# EAGLE design Qwiic_High_Performance_Magnetometer (EAGLE 9.6.2)
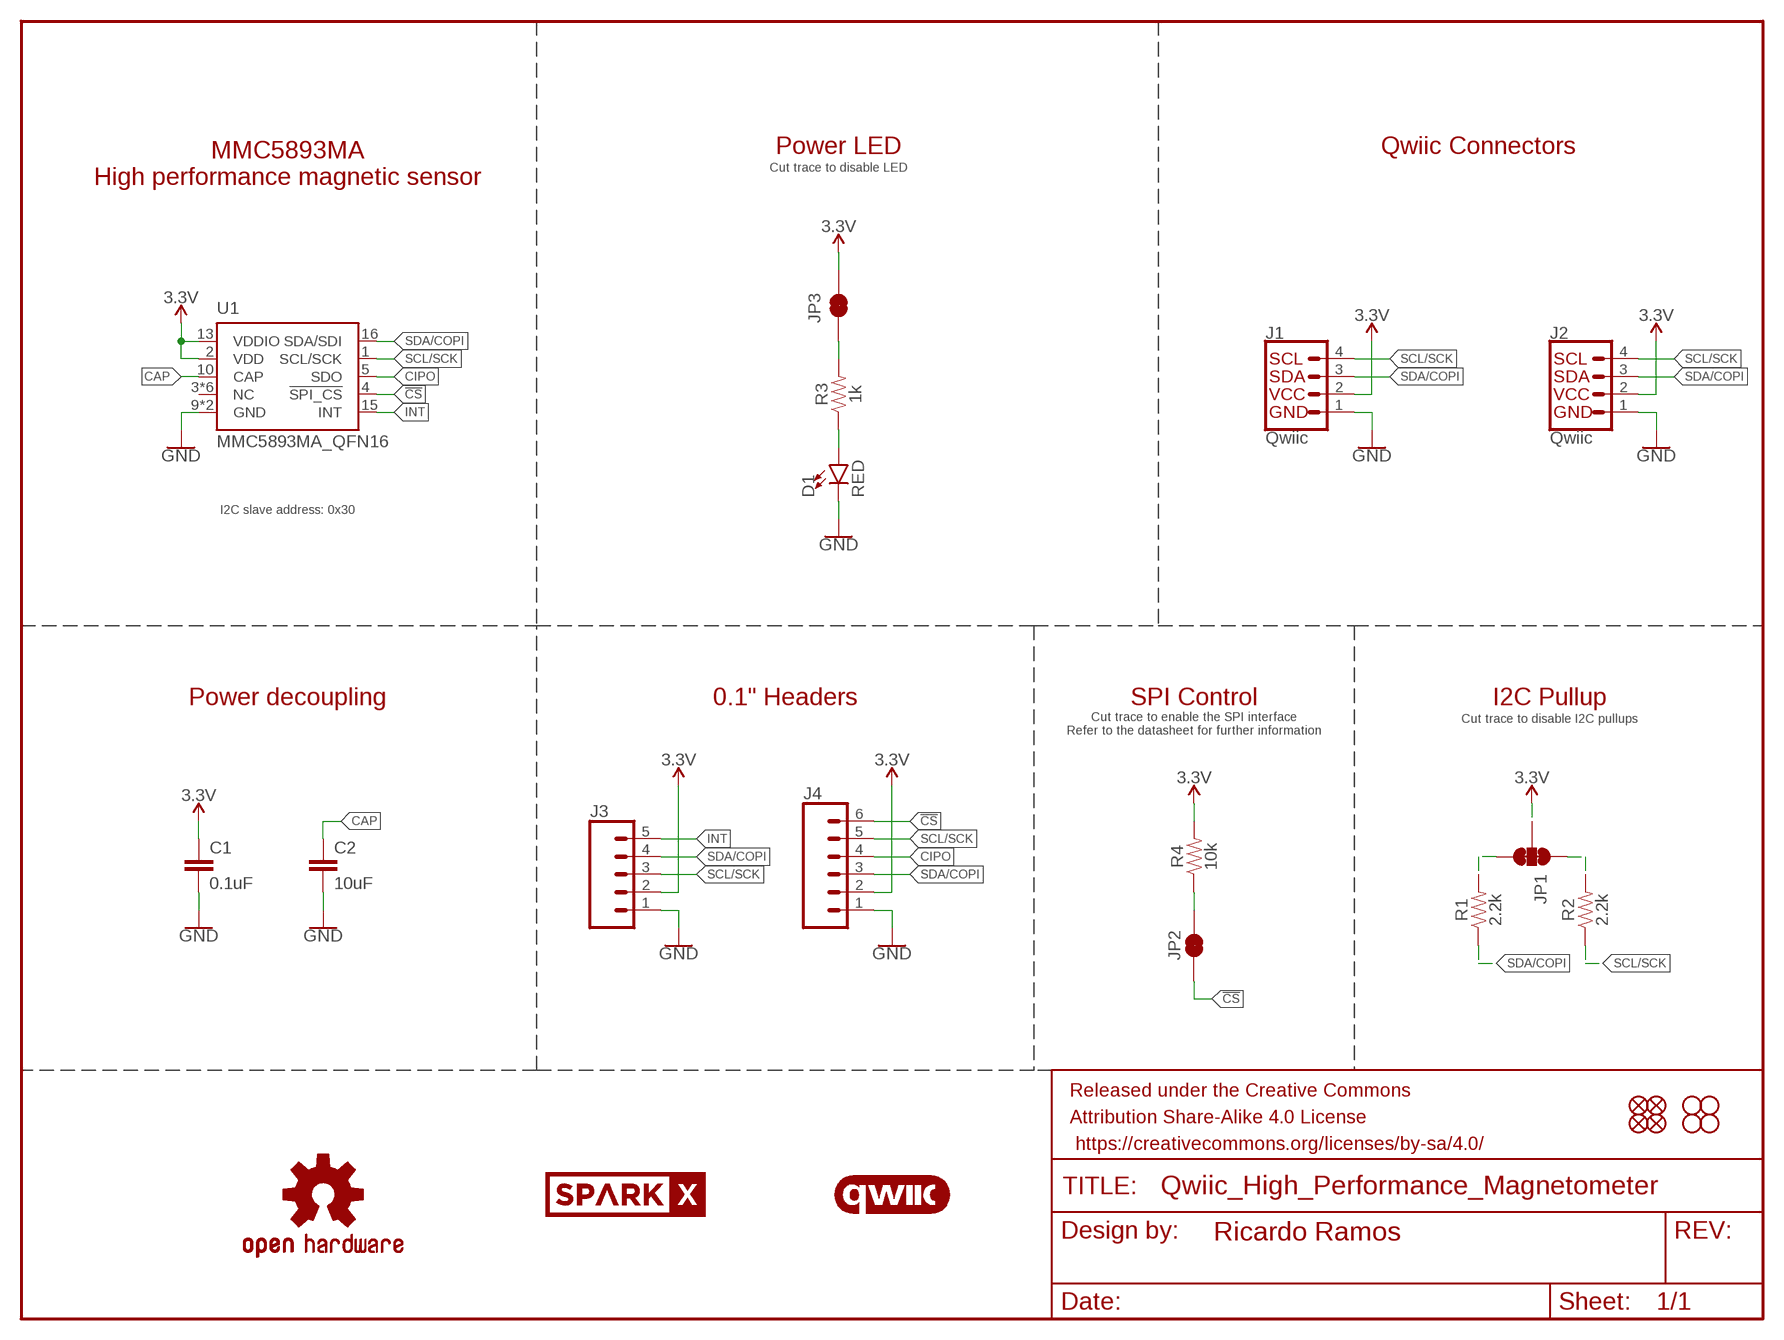
[diagram p0: schematic, sheet 1]

## Parts
C1  0.1uF  0.1UF-0603-25V-(+80/-20%)  [0603]
C2  10uF  10UF-0603-6.3V-20%  [0603]
D1  RED  LED-RED0603  [LED-0603]
FD1  FIDUCIAL1X2  [FIDUCIAL-1X2]
FD2  FIDUCIAL1X2  [FIDUCIAL-1X2]
FD3  FIDUCIAL1X2  [FIDUCIAL-1X2]
FD4  FIDUCIAL1X2  [FIDUCIAL-1X2]
FRAME1  FRAME-LETTERNO_PACKAGE  [DUMMY]
H1  STAND-OFF  [STAND-OFF]
H2  STAND-OFF  [STAND-OFF]
H3  STAND-OFF  [STAND-OFF]
H4  STAND-OFF  [STAND-OFF]
J1  Qwiic  QWIIC_CONNECTORJS-1MM  [JST04_1MM_RA]
J2  Qwiic  QWIIC_CONNECTORJS-1MM  [JST04_1MM_RA]
J3  CONN_05NO_SILK  [1X05_NO_SILK]
J4  CONN_06NO_SILK_NO_POP  [1X06_NO_SILK]
JP1  JUMPER-SMT_3_2-NC_TRACE_SILK  [SMT-JUMPER_3_2-NC_TRACE_SILK]
JP2  JUMPER-SMT_2_NC_TRACE_SILK  [SMT-JUMPER_2_NC_TRACE_SILK]
JP3  JUMPER-SMT_2_NC_TRACE_SILK  [SMT-JUMPER_2_NC_TRACE_SILK]
LOGO1  OSHW-LOGOMINI  [OSHW-LOGO-MINI]
LOGO2  QWIIC_LOGO_5MM  [QWIIC_5MM]
R1  2.2k  2.2KOHM-0603-1/10W-1%  [0603]
R2  2.2k  2.2KOHM-0603-1/10W-1%  [0603]
R3  1k  1KOHM-0603-1/10W-1%  [0603]
R4  10k  10KOHM-0603-1/10W-1%  [0603]
U1  MMC5893MA_QFN16  [LGA-16-3X3MM-4X4PINS]
U$36  SPARKX-LOGO2  [SPARKX-TINY]
U$37  SPARKX-LOGO3  [SPARKX-SMALL]

## Nets
3.3V: C1.1 J1.2 J2.2 J3.2 J4.2 JP1.2 JP3.2 R4.2 U1.2(VDD) U1.13(VDDIO)
!CS!: J4.6 JP2.1 U1.4(!SPI_CS!)
CAP: C2.1 U1.10(CAP)
CIPO: J4.4 U1.5(SDO)
GND: C1.2 C2.2 D1.C J1.1 J2.1 J3.1 J4.1 U1.9(GND) U1.11(GND)
INT: J3.5 U1.15(INT)
N$1: JP3.1 R3.2
N$2: JP1.1 R2.2
N$3: JP1.3 R1.2
N$4: D1.A R3.1
N$5: JP2.2 R4.1
SCL/SCK: J1.4 J2.4 J3.3 J4.5 R2.1 U1.1(SCL/SCK)
SDA/COPI: J1.3 J2.3 J3.4 J4.3 R1.1 U1.16(SDA/SDI)
Unconnected: U1.3(NC) U1.6(NC) U1.7(NC) U1.8(NC) U1.12(NC) U1.14(NC)

## Notes on the sheet
- Power LED | Qwiic Connectors
- MMC5893MA
  High performance magnetic sensor
- Cut trace to disable LED
- I2C slave address: 0x30
- Power decoupling | 0.1" Headers | SPI Control | I2C Pullup
- Cut trace to enable the SPI interface
  Refer to the datasheet for further information
- Cut trace to disable I2C pullups

## Library data of the parts
C1 = SparkFun-Capacitors:0.1UF: 0.1µF ceramic capacitors A capacitor is a passive two-terminal electrical component used to store electrical energy temporarily in an electric field.; PROD_ID: CAP-00810
C2 = SparkFun-Capacitors:10UF: 10.0µF ceramic capacitors A capacitor is a passive two-terminal electrical component used to store electrical energy temporarily in an electric field.; PROD_ID: CAP-11015
D1 = SparkFun-LED:LED-RED: Red SMD LED Used in manufacturing of most products at SparkFun Packages: 0603 - SMD 0603 package [Product Link] <http://docs.avagotech.com/docs/AV02-0551EN> 0603 SMART - SMD 0603 SMART package ( more efficient and expensive)[Product Link] <http://www.osram-os.com/Graphics/XPic2/00077099_0.pdf> 1206 - SMD1206 package [Product Link] <https://www.sparkfun.com/datasheets/DevTools/LilyPad/Q150OVS4.pdff> SparkFun Products: Pro Mini 328 -5V <https://www.sparkfun.com/products/821> RedBoard <https://www.sparkfun.com/products/12757> IOIO-OTG <https://www.sparkfun.com/products/13613>; PROD_ID: DIO-00819
FD1-FD4 = SparkFun-Aesthetics:FIDUCIAL: Fiducial Alignment Points Point-of-reference for pick-and-place machines and other optical instruments.
FRAME1 = SparkFun-Aesthetics:FRAME-LETTER: Schematic Frame - Letter Standard 8.5x11 US Letter frame; DESIGNER: Ricardo Ramos; VERSION: v01
H1-H4 = SparkFun-Hardware:STAND-OFF: Stand Off Drill holes for mechanically mounting via screws, standoffs, etc. Note: Use the keepout ring to avoid running the screw head into surrounding components. Variant Overviews STAND-OFF - Mechanical footprint for a #4 phillips button head screw. STAND-OFF-TIGHT - Mechanical footprint for a #4 phillips button head screw, Example SparkFun Products Screw - Phillips Head (1/4", 4-40, 10 pack) <https://www.sparkfun.com/products/10453> (PRT-10453) Screw - Phillips Head (1/2", 4-40, 10 pack) <https://www.sparkfun.com/products/10452> (PRT-10452) Screw - Phillips Head (3/4", 4-40, 10 pack) <https://www.sparkfun.com/products/10451> (PRT-10451) Screw - Phillips Head (1", 4-40, 10 pack) <https://www.sparkfun.com/products/10450> (PRT-10450)
J1 J2 = SparkFun-Connectors:QWIIC_CONNECTOR: SparkFun I2C Standard Qwiic Connector An SMD 1mm pitch JST connector makes it easy and quick (get it? Qwiic?) to connect I2C devices to each other. The Qwiic system <http://www.sparkfun.com/qwiic> enables fast and solderless connection between popular platforms and various sensors and actuators. We carry 200mm <https://www.sparkfun.com/products/14204>, 100mm <https://www.sparkfun.com/products/14205>, 50mm <https://www.sparkfun.com/products/14206>, and breadboard friendly <https://www.sparkfun.com/products/14207> Qwiic cables. We also offer 10 pcs strips <https://www.sparkfun.com/products/14323> the SMD connectors.; PROD_ID: CONN-13694; VALUE: QWIIC_RIGHT_ANGLE
J3 = SparkFun-Connectors:CONN_05: Multi connection point. Often used as Generic Header-pin footprint for 0.1 inch spaced/style header connections On any of the 0.1 inch spaced packages, you can populate with these: Break Away Headers - Straight <https://www.sparkfun.com/products/116> (PRT-00116) Break Away Male Headers - Right Angle <https://www.sparkfun.com/products/553> (PRT-00553) Female Headers <https://www.sparkfun.com/products/115> (PRT-00115) Break Away Headers - Machine Pin <https://www.sparkfun.com/products/117> (PRT-00117) Break Away Female Headers - Swiss Machine Pin <https://www.sparkfun.com/products/743> (PRT-00743) For SCREWTERMINALS and SPRING TERMINALS visit here: Screw Terimnals on SparkFun.com <https://www.sparkfun.com/search/results?term=Screw+Terminals> (5mm/3.5mm/2.54mm spacing) This device is also useful as a general connection point to wire up your design to another part of your project. Our various solder wires solder well into these plated through hole pads. Hook-Up Wire - Assortment (Stranded, 22 AWG) <https://www.sparkfun.com/products/11375> (PRT-11375) Hook-Up Wire - Assortment (Solid Core, 22 AWG) <https://www.sparkfun.com/products/11367> (PRT-11367) View the entire wire category on our website here <https://www.sparkfun.com/categories/141> Special notes: Molex polarized connector foot print use with SKU : PRT-08231 with associated crimp pins and housings. 1MM SMD Version SKU: PRT-10208
J4 = SparkFun-Connectors:CONN_06: Multi connection point. Often used as Generic Header-pin footprint for 0.1 inch spaced/style header connections On any of the 0.1 inch spaced packages, you can populate with these: Break Away Headers - Straight <https://www.sparkfun.com/products/116> (PRT-00116) Break Away Male Headers - Right Angle <https://www.sparkfun.com/products/553> (PRT-00553) Female Headers <https://www.sparkfun.com/products/115> (PRT-00115) Break Away Headers - Machine Pin <https://www.sparkfun.com/products/117> (PRT-00117) Break Away Female Headers - Swiss Machine Pin <https://www.sparkfun.com/products/743> (PRT-00743) Arduino Stackable Header - 6 Pin <https://www.sparkfun.com/products/9280> (PRT-09280) For SCREWTERMINALS and SPRING TERMINALS visit here: Screw Terimnals on SparkFun.com <https://www.sparkfun.com/search/results?term=Screw+Terminals> (5mm/3.5mm/2.54mm spacing) This device is also useful as a general connection point to wire up your design to another part of your project. Our various solder wires solder well into these plated through hole pads. Hook-Up Wire - Assortment (Stranded, 22 AWG) <https://www.sparkfun.com/products/11375> (PRT-11375) Hook-Up Wire - Assortment (Solid Core, 22 AWG) <https://www.sparkfun.com/products/11367> (PRT-11367) View the entire wire category on our website here <https://www.sparkfun.com/categories/141>
JP1 = SparkFun-Jumpers:JUMPER-SMT_3_2-NC_TRACE: Normally closed trace jumper (2 of 2 connections) This jumper has a trace between all three pads so they are normally closed (NC). Use a razor knife to open the connection(s). For best results follow the IPC guidelines for cutting traces: Cutout at least 0.063 mm (0.005 in). Remove all loose material to clean up the cut area. Seal the cut with an approved epoxy. Reapply solder to reclose the connection(s).
JP2 JP3 = SparkFun-Jumpers:JUMPER-SMT_2_NC_TRACE: Normally closed trace jumper This jumper has a trace between two pads so it's normally closed (NC). Use a razor knife to open the connection. For best results follow the IPC guidelines for cutting traces: Cutout at least 0.063 mm (0.005 in). Remove all loose material to clean up the cut area. Seal the cut with an approved epoxy. Reapply solder to reclose the connection.
LOGO1 = SparkFun-Aesthetics:OSHW-LOGO: Open-Source Hardware (OSHW) Logo This logo indicates the piece of hardware it is found on incorporates a OSHW license and/or adheres to the definition of open source hardware found here: http://freedomdefined.org/OSHW
LOGO2 = SparkFun-Aesthetics:QWIIC_LOGO: Qwiic Logos for placement on schematic and PCB. The 5.5mm silk logo is best for placing next to Qwiic connector.
R1 R2 = SparkFun-Resistors:2.2KOHM: 2.2kΩ resistor A resistor is a passive two-terminal electrical component that implements electrical resistance as a circuit element. Resistors act to reduce current flow, and, at the same time, act to lower voltage levels within circuits. - Wikipedia; PROD_ID: RES-08272
R3 = SparkFun-Resistors:1KOHM: 1kΩ resistor A resistor is a passive two-terminal electrical component that implements electrical resistance as a circuit element. Resistors act to reduce current flow, and, at the same time, act to lower voltage levels within circuits. - Wikipedia; PROD_ID: RES-07856
R4 = SparkFun-Resistors:10KOHM: 10kΩ resistor A resistor is a passive two-terminal electrical component that implements electrical resistance as a circuit element. Resistors act to reduce current flow, and, at the same time, act to lower voltage levels within circuits. - Wikipedia; PROD_ID: RES-00824
U1 = SparkFun-Sensors:MMC5893MA: High Performance 3-axis Magnetic Sensor The MMC5983MA is an AEC-Q100 qualified complete 3-axis magnetic sensor with on-chip signal processing and integrated I2C/SPI bus suitable for use in automotive applications. The device can be connected directly to a microprocessor, eliminating the need for A/D converters or timing resources. It can measure magnetic fields within the full scale range of ±8 Gauss (G), with 0.25mG/0.0625mG per LSB resolution at 16bits/18bits operation mode and 0.4 mG total RMS noise level, enabling heading accuracy of ±0.5° in electronic compass applications.; PROD_ID: IC-16314
U$36 U$37 = SparkX:SPARKX-LOGO

## Board
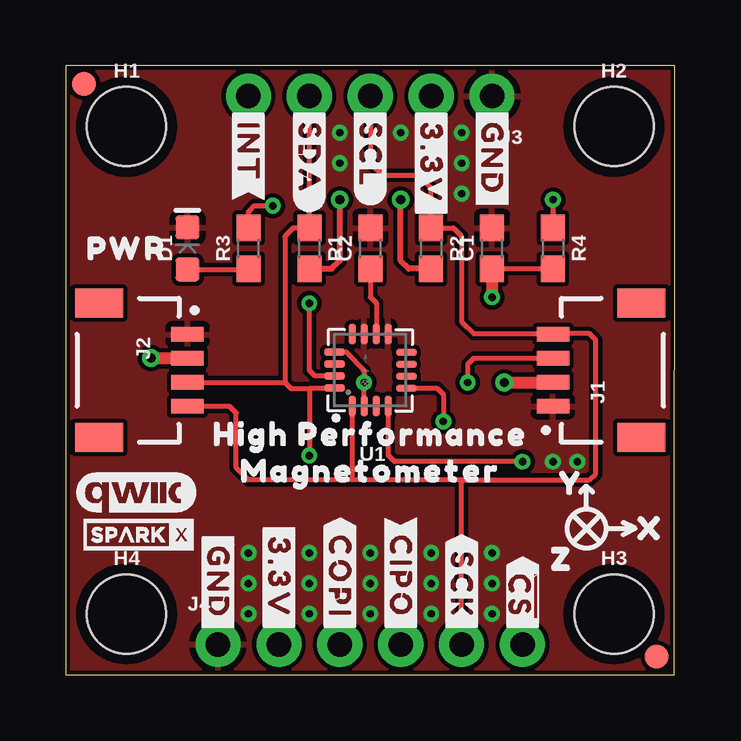
[diagram p1: board, top side]
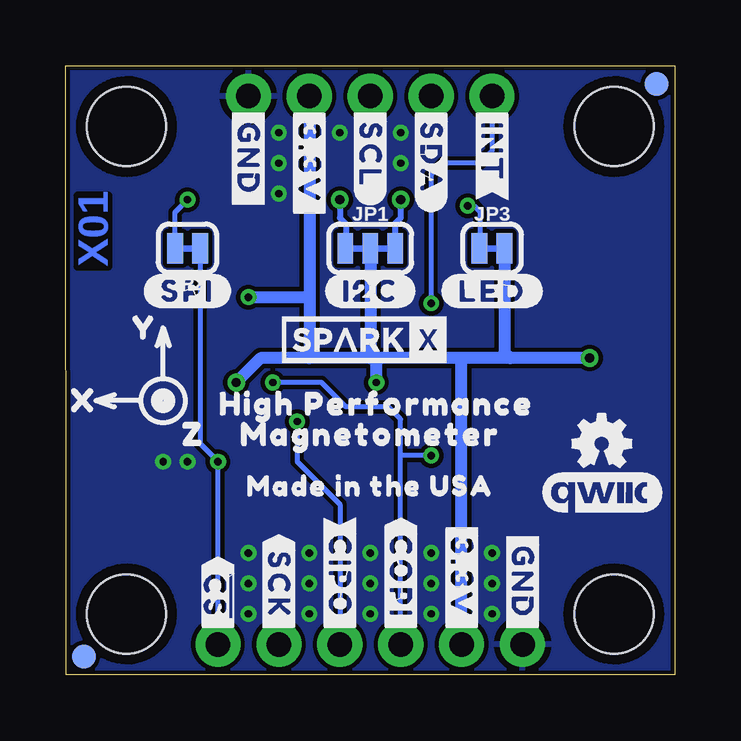
[diagram p2: board, bottom side, seen from below]

Size 25.4 x 25.4 mm. Coordinates in mm from the lower left corner, seen from the top.
Outline: 0,0 25.38,0 25.4,25.4 0,25.4 0,0
Copper layers (1*16): Top 0.035mm / dielectric 1.5mm / Bottom 0.035mm
Design rules "SparkFun-2-Layer-General-JLCPCB": minimum track width 7mil, minimum drill 0.3mm, track to track 7mil, track to pad 7mil, pad to pad 7mil, via to via 7mil, smd to smd 7mil, copper to edge 7mil, drill to drill 7mil, minimum pad ring 7mil, minimum via ring 7mil, stop-mask expansion 4mil, vias tented up to drill 25mil, thermal gap 10mil

### Footprints (pad centres in the part's own frame; a part is rotated, then mirrored left to right if it is on the bottom)
0603 = smd 1.1 x 1: 1 -0.85,0; 2 0.85,0
LED-0603 = smd 1 x 1: A -0.877,0; C 0.877,0
FIDUCIAL-1X2 = smd 1 x 1: 1 0,0
STAND-OFF = hole 3.302: 0,0
JST04_1MM_RA = smd 0.6 x 1.35: 1 -1.5,0; 2 -0.5,0; 3 0.5,0; 4 1.5,0 | smd 1.2 x 2: NC1 2.8,-3.675; NC2 -2.8,-3.675
1X05_NO_SILK = drill 1.016 pad 1.88: 1 0,0; 2 2.54,0; 3 5.08,0; 4 7.62,0; 5 10.16,0
1X06_NO_SILK = drill 1.016 pad 1.88: 1 0,0; 2 2.54,0; 3 5.08,0; 4 7.62,0; 5 10.16,0; 6 12.7,0
SMT-JUMPER_3_2-NC_TRACE_SILK = smd 0.66 x 1.27: 1 -1.041,0; 2 0,0; 3 1.041,0
SMT-JUMPER_2_NC_TRACE_SILK = smd 0.66 x 1.27: 1 -0.521,0; 2 0.521,0
LGA-16-3X3MM-4X4PINS = smd 0.3 x 0.85: 1 0.754,1.498; 2 0.254,1.498; 3 -0.246,1.498; 4 -0.746,1.498; 9 -0.746,-1.506; 10 -0.246,-1.506; 11 0.254,-1.506; 12 0.754,-1.506 | smd 0.85 x 0.3: 5 -1.508,0.746; 6 -1.508,0.246; 7 -1.508,-0.254; 8 -1.508,-0.754; 13 1.496,-0.764; 14 1.496,-0.264; 15 1.496,0.236; 16 1.496,0.736

### Placement (x,y rotation side)
C1  17.78,17.78 90 top
C2  12.7,17.78 90 top
D1  5.08,17.78 90 top
FD1  24.64,0.76 0 top
FD2  0.76,24.64 0 top
FD3  0.76,24.64 0 bottom
FD4  24.64,0.76 0 bottom
FRAME1  0,0 0 top
H1  2.54,22.86 0 top
H2  22.86,22.86 0 top
H3  22.86,2.54 0 top
H4  2.54,2.54 0 top
J1  20.32,12.7 90 top
J2  5.08,12.7 270 top
J3  17.78,24.13 180 top
J4  6.35,1.27 0 top
JP1  12.7,17.78 0 bottom
JP2  20.32,17.78 180 bottom
JP3  7.62,17.78 0 bottom
LOGO1  3.05,9.65 0 bottom
LOGO2  3.05,7.62 0 bottom
LOGO3  QWIIC_LOGO_5MM  [QWIIC_5MM]  2.92,7.62 0 top
R1  10.16,17.78 270 top
R2  15.24,17.78 270 top
R3  7.62,17.78 90 top
R4  20.32,17.78 270 top
U1  12.7,12.7 180 top
U$1  [HIGH_PERFORMANCE11]  12.45,11.3 0 bottom
U$2  [#SCL#6]  12.7,23.75 270 top
U$3  [#3#3V#0]  15.24,23.75 270 top
U$4  [#GND#4]  17.78,23.75 270 top
U$5  [#SDA#5]  10.16,23.75 270 top
U$6  [#CIPO#11]  13.97,1.65 270 top
U$7  [#INT#7]  7.62,23.75 270 top
U$8  [PWR9]  2.54,17.78 0 top
U$9  [#COPI#12]  11.43,1.65 270 top
U$10  [HIGH_PERFORMANCE11]  12.7,10.03 0 top
U$11  [MAGNETOMETER12]  12.7,8.51 0 top
U$12  [#3#3V#0]  15.24,23.75 270 bottom
U$13  [#GND#4]  17.78,23.75 270 bottom
U$14  [#SCK#13]  16.51,1.65 270 top
U$15  [##CS##10]  19.05,1.65 270 top
U$16  [#INT#7]  7.62,23.75 270 bottom
U$17  [#GND#4]  6.35,6.1 270 top
U$18  [#3#3V#0]  8.89,6.48 270 top
U$19  [Y16]  21.08,8 0 top
U$20  [X15]  24.38,6.1 0 top
U$21  [#LED#8]  7.62,16 0 bottom
U$22  [#I2C#9]  12.7,16 0 bottom
U$23  [#SPI#9]  20.32,16 0 bottom
U$24  [MAGNETOMETER12]  12.7,10.03 0 bottom
U$25  [X15]  24.64,11.43 0 bottom
U$26  [Y16]  22.1,14.48 0 bottom
U$27  [Z17]  20.07,10.03 0 bottom
U$28  [#GND#4]  6.35,6.1 270 bottom
U$29  [#3#3V#0]  8.89,6.48 270 bottom
U$30  [#COPI#12]  11.43,1.65 270 bottom
U$31  [#CIPO#11]  13.97,1.65 270 bottom
U$32  [#SCK#13]  16.51,1.65 270 bottom
U$33  [##CS##10]  19.05,1.65 270 bottom
U$34  [MADE_IN_THE_USA20]  12.7,7.87 0 bottom
U$35  [#SCL#6]  12.7,23.75 270 bottom
U$36  3.05,5.84 0 top
U$37  12.95,13.97 0 bottom
U$38  [#SDA#5]  10.16,23.75 270 bottom
U$39  [Z17]  20.7,4.83 0 top

### Tracks (layer width: path | path; a pad name or v marks a point on that pad's centre or on a via)
3.3V  (via drill 0.3, 0.38)
  Top 0.203: C1.1 R4.2 | U1.2 v12.45,12.19 12.45,12.7 11.68,13.46 U1.13
  Top 0.508: J2.2 v3.56,13.2 v3.56,13.21 | v18.29,12.19 J1.2 | C1.1 v17.78,15.75
  Bottom 0.508: v3.56,13.21 6.86,13.21 | 6.86,13.21 8.89,13.21 | 8.89,13.21 12.45,13.21 | 12.45,13.21 12.7,13.21 | 12.7,13.21 15.24,13.21 | 15.24,13.21 17.27,13.21 v18.29,12.19 | J3.2 15.24,15.75 | 15.24,15.75 15.24,13.21 | J4.2 8.89,13.21 | JP1.2 12.7,13.21 | v17.78,15.75 15.24,15.75 | JP3.2 7.1,13.45 6.86,13.21 | v12.45,12.19 12.45,13.21
!CS!  (via drill 0.3)
  Top 0.203: U1.4 13.45,9.16 13.72,8.89 v19.05,8.89
  Bottom 0.203: J4.6 v19.05,8.89 19.8,9.64 JP2.1
CAP
  Top 0.203: C2.1 12.7,15.75 12.95,15.49 U1.10
CIPO  (via drill 0.3)
  Top 0.203: U1.5 15.48,11.95 15.75,11.68 v15.75,10.57
  Bottom 0.203: J4.4 13.97,7.11 15.75,8.89 v15.75,10.57
GND  (via drill 0.3)
  other vias: 11.43,21.34 11.43,22.61 13.97,22.61 16.51,21.34 16.51,22.61 20.32,8.89 21.34,8.89 17.78,3.81 17.78,5.08 17.78,2.54 10.16,3.81 10.16,5.08 10.16,2.54 7.62,3.81 7.62,5.08 7.62,2.54 12.7,3.81 12.7,5.08 12.7,2.54 15.24,3.81 15.24,5.08 15.24,2.54 16.51,20.07
  pour Top (isolate 0.152): 0,25.4 25.4,25.4 25.4,0 0,0
  pour Bottom (isolate 0.152): 0,25.4 25.4,25.4 25.4,0 0,0
INT  (via drill 0.3)
  Top 0.203: U1.15 10.4,12.46 10.16,12.7 v10.16,15.49
  Bottom 0.203: J3.5 7.62,21.84 8.13,21.34 9.65,21.34 10.16,20.83 v10.16,15.49
N$1  (via drill 0.3)
  Top 0.203: R3.2 7.62,19.3 7.87,19.56 v8.64,19.56
  Bottom 0.203: v8.64,19.56 8.38,19.56 8.13,19.3 8.13,17.79 JP3.1
N$2  (via drill 0.38)
  Top 0.254: R2.2 14.31,16.93 13.97,17.27 v13.97,19.81
  Bottom 0.254: v13.97,19.81 13.97,19.05 13.72,18.8 13.72,17.8 JP1.1
N$3  (via drill 0.38)
  Top 0.254: R1.2 11.09,16.93 11.43,17.27 v11.43,19.81
  Bottom 0.254: v11.43,19.81 11.43,19.05 11.66,18.82 JP1.3
N$4
  Top 0.203: D1.A 7.59,16.9 R3.1
N$5  (via drill 0.3)
  Top 0.203: v20.32,19.81 R4.1
  Bottom 0.203: JP2.2 20.84,19.29 v20.32,19.81
SCL/SCK
  Top 0.203: U1.1 11.95,8.13 | 16.51,8.13 11.95,8.13 | J4.5 16.51,8.13 | 11.95,8.13 7.62,8.13 7.11,8.64 7.11,10.92 6.83,11.2 J2.4 | J3.3 12.7,21.34 13.21,20.83 14.73,20.83 15.24,20.32 R2.1 16.17,18.63 16.51,18.29 16.51,14.73 17.02,14.22 20.34,14.22 | 16.51,8.13 21.84,8.13 22.1,8.38 22.1,13.97 21.84,14.22 20.34,14.22 | 20.34,14.22 J1.4
SDA/COPI  (via drill 0.3)
  Top 0.203: J3.4 R1.1 9.49,18.63 9.14,18.29 9.14,12.2 | J2.3 9.14,12.2 | 10.16,11.94 11.18,11.94 U1.16 | 10.16,11.94 v10.16,9.14 | v16.76,12.19 16.76,12.95 17.02,13.21 J1.3 | 9.14,12.2 9.41,11.94 10.16,11.94
  Bottom 0.203: J4.3 11.43,9.14 | 11.43,9.14 11.43,10.67 11.94,11.18 13.72,11.18 14.73,12.19 v16.76,12.19 | v10.16,9.14 11.43,9.14

### Text on the board
Bottom: X01
Measures: Dimensions in inches